# EAGLE design fonte (EAGLE 7.2.0)
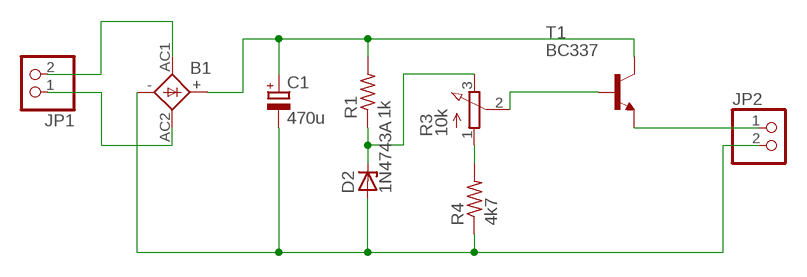
[diagram p0: schematic, sheet 1]

## Parts
B1  1KAB  [1KAB]
C1  470u  CPOL-EUE3.5-10  [E3,5-10]
D2  1N4743A  BZX85  [DO41Z10]
JP1  PINHD-1X2  [1X02]
JP2  PINHD-1X2  [1X02]
R1  1k  R-US_0309/12  [0309/12]
R3  10k  3RP/1610N  [3RP/1610N]
R4  4k7  R-US_0309/12  [0309/12]
T1  BC337  [TO92]

## Nets
N$1: B1.AC1 JP1.2
N$2: B1.AC2 JP1.1
N$3: B1.+ C1.+ R1.2 T1.3(C)
N$4: B1.- C1.- D2.A JP2.2 R4.1
N$5: D2.C R1.1 R3.3(E)
N$6: R3.1(A) R4.2
N$7: R3.2(S) T1.2(B)
N$9: JP2.1 T1.1(E)

## Library data of the parts
B1 = rectifier:1KAB: RECTIFIER grid 5,08 x 5,08 mm
C1 = rcl:CPOL-EU: POLARIZED CAPACITOR, European symbol
D2 = diode:BZX85: Z DIODE
JP1 JP2 = pinhead:PINHD-1X2: PIN HEADER
R1 R4 = rcl:R-US_: RESISTOR, American symbol
R3 = pot:3RP/1610N: 16mm Potentiometer one level Source: http://www.alphapotentiometers.net/html/16mm_pot_2.html
T1 = transistor:BC337: NPN TRANSISTOR

## Board
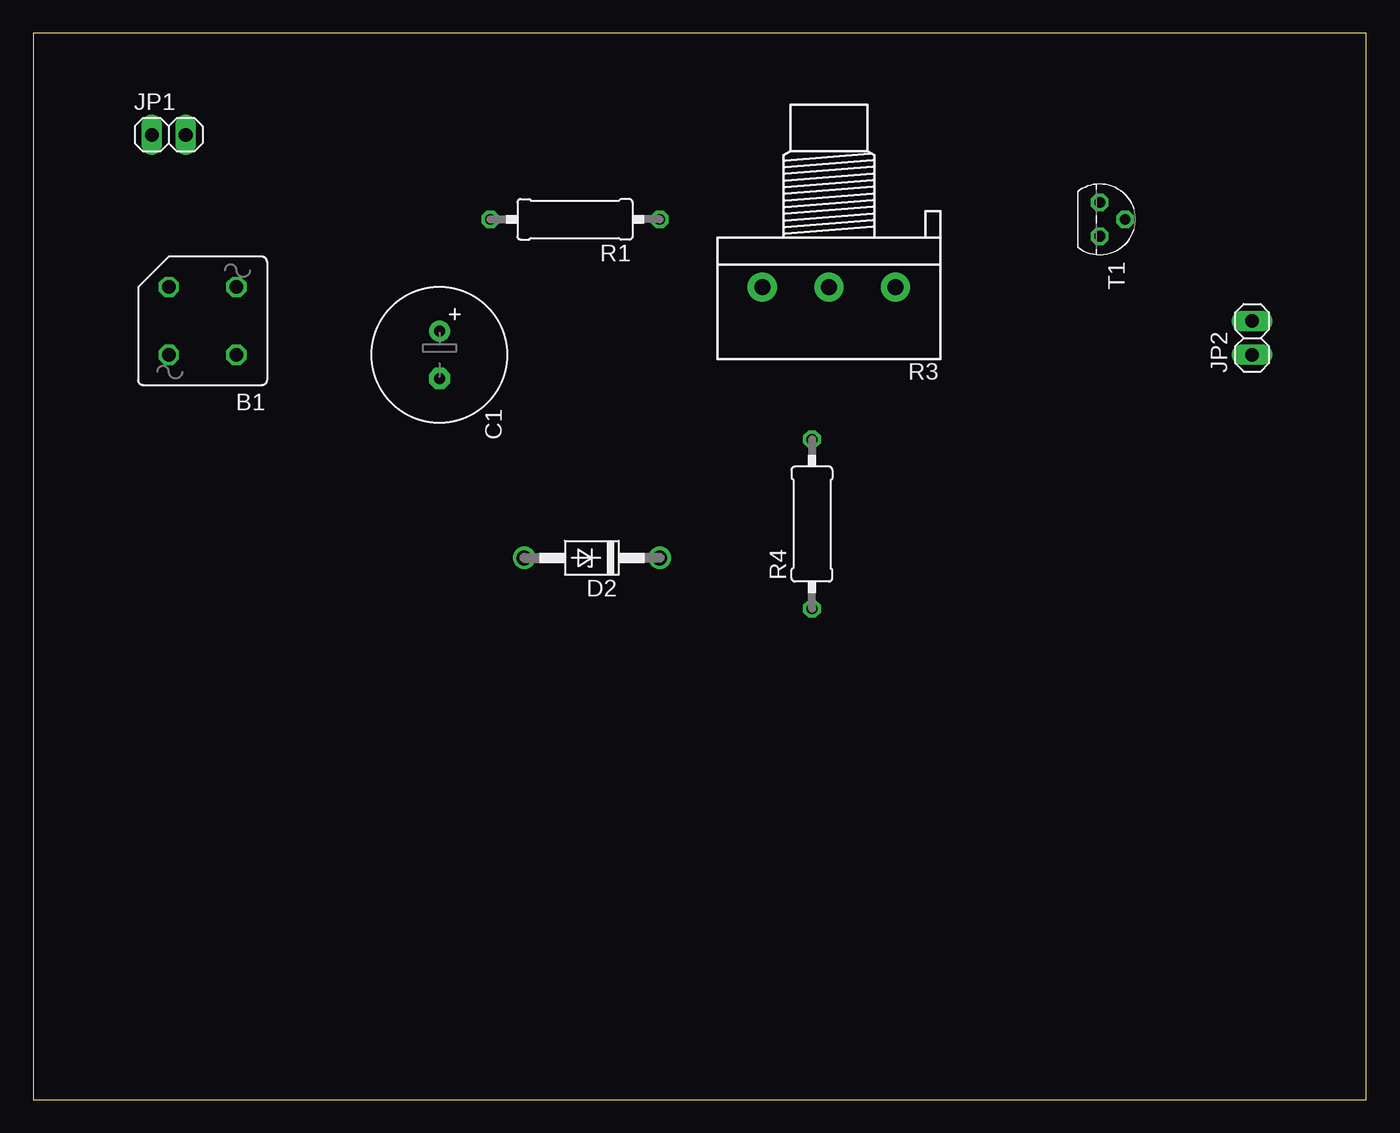
[diagram p1: board, top side]
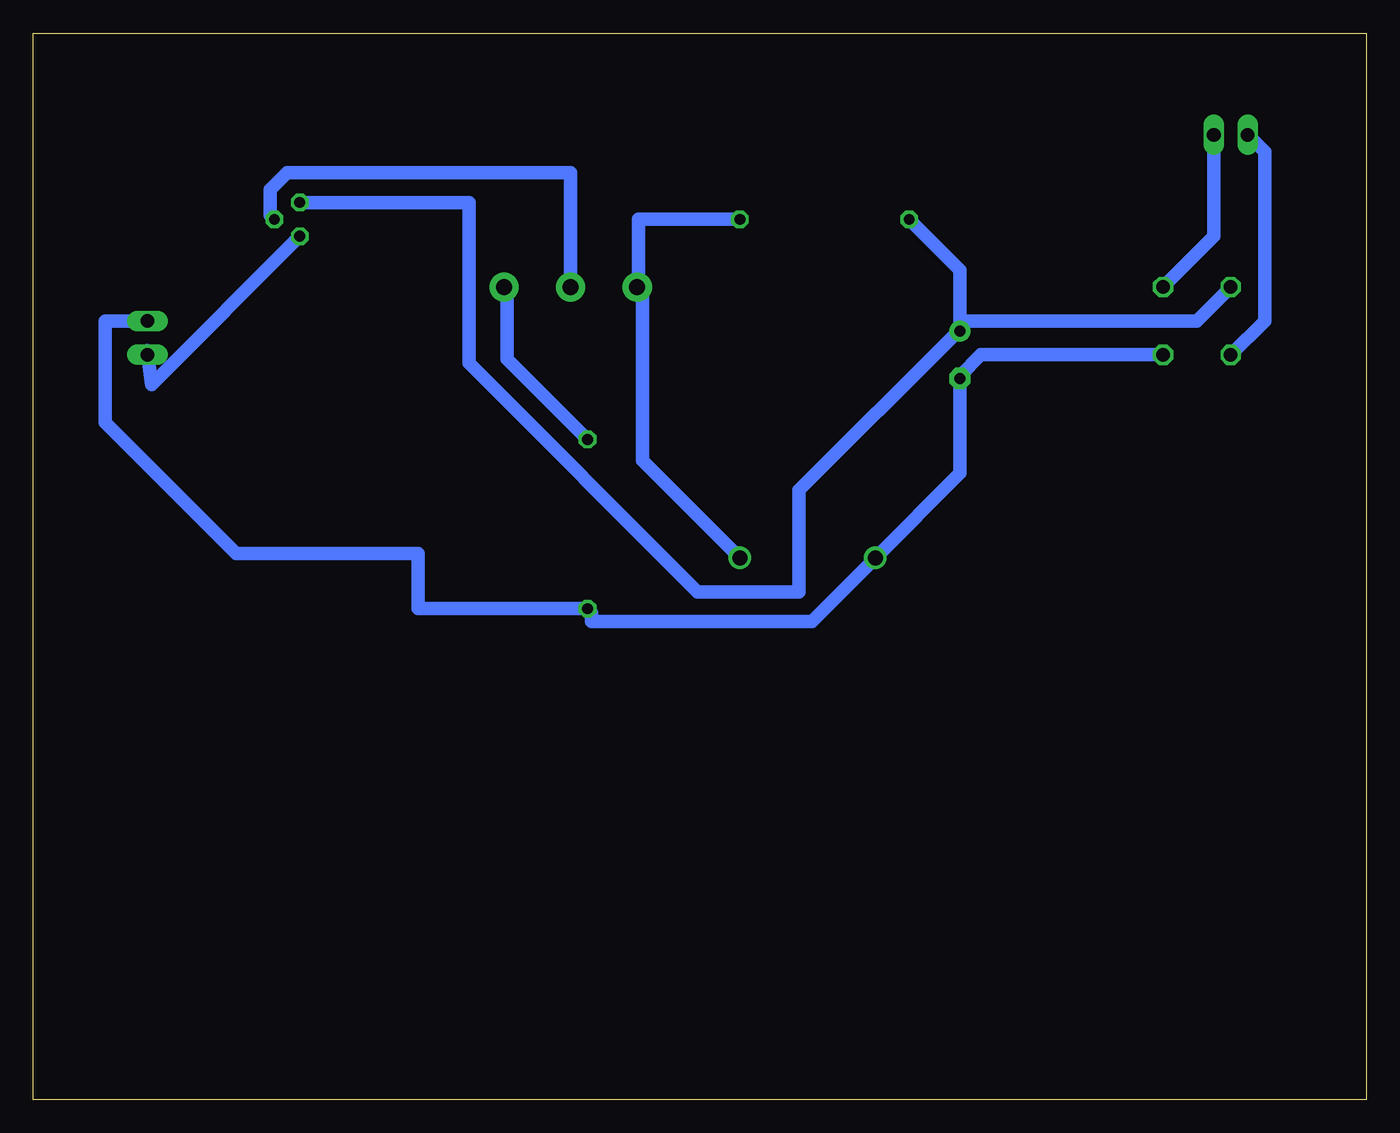
[diagram p2: board, bottom side, seen from below]

Size 100 x 80 mm. Coordinates in mm from the lower left corner, seen from the top.
Outline: 0,0 100,0 100,80 0,80 0,0
Copper layers (1*16): Top 0.035mm / dielectric 1.5mm / Bottom 0.035mm
Design rules "default *": minimum track width 40mil, minimum drill 0.35mm, track to track 40mil, track to pad 40mil, pad to pad 40mil, via to via 40mil, smd to smd 8mil, copper to edge 40mil, drill to drill 8mil, minimum pad ring 10mil, minimum via ring 8mil, stop-mask expansion 4mil, vias tented up to drill 0mil, thermal gap 10mil

### Footprints (pad centres in the part's own frame; a part is rotated, then mirrored left to right if it is on the bottom)
1KAB = drill 1.016 octagon: + 2.54,-2.54; - -2.54,2.54; AC1 -2.54,-2.54; AC2 2.54,2.54
E3,5-10 = drill 0.813 pad 1.6: + -1.778,0 | drill 0.813 pad 1.6 octagon: - 1.778,0
DO41Z10 = drill 1.118: A 5.08,0; C -5.08,0
1X02 = drill 1.016 long: 1 -1.27,0; 2 1.27,0
0309/12 = drill 0.813 octagon: 1 -6.35,0; 2 6.35,0
3RP/1610N = drill 1.2 pad 2.184: 1 -5,0; 2 0,0; 3 5,0
TO92 = drill 0.813 octagon: 1 1.27,0; 2 0,1.905; 3 -1.27,0

### Placement (x,y rotation side)
B1  12.7,58.42 180 top
C1  30.48,55.88 270 top
D2  41.91,40.64 180 top
JP1  10.16,72.39 0 top
JP2  91.44,57.15 90 top
R1  40.64,66.04 180 top
R3  59.69,60.96 180 top
R4  58.42,43.18 90 top
T1  80.01,66.04 270 top

### Tracks (layer width: path | path; a pad name or v marks a point on that pad's centre or on a via)
N$1
  Bottom 1.016: B1.AC1 11.43,64.77 JP1.2
N$2
  Bottom 1.016: B1.AC2 7.62,58.42 7.62,71.12 JP1.1
N$3
  Bottom 1.016: R1.2 30.48,62.23 C1.+ | T1.3 67.31,67.31 67.31,55.24 50.16,38.1 42.55,38.1 42.55,45.72 30.8,57.47 C1.+ | B1.+ 12.7,58.42 30.16,58.42 C1.+
N$4
  Bottom 1.016: B1.- 28.89,55.88 30.48,54.29 C1.- 30.48,46.99 D2.A 41.59,35.88 58.1,35.88 58.1,36.51 R4.1 71.12,36.83 71.12,40.96 84.77,40.96 94.61,50.8 94.61,58.42 JP2.2
N$5
  Bottom 1.016: R1.1 54.61,66.04 54.61,60.96 R3.3 54.29,60.64 54.29,47.94 D2.C
N$6
  Bottom 1.016: R4.2 64.45,55.56 64.45,60.96 R3.1
N$7
  Bottom 1.016: T1.2 82.23,66.36 82.23,68.26 80.96,69.53 59.69,69.53 R3.2
N$9
  Bottom 1.016: JP2.1 91.44,56.2 91.12,53.66 T1.1